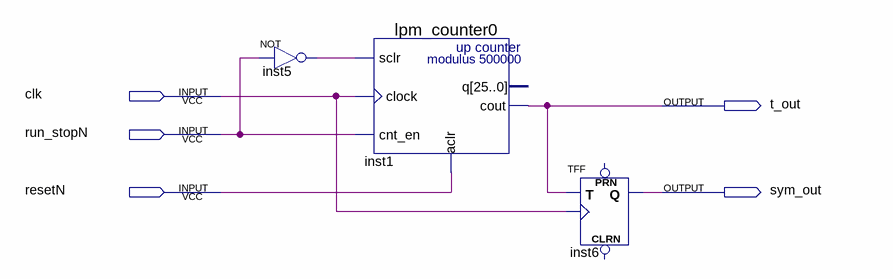
[diagram p0: schematic sheet]
// Quartus schematic secgen.bdf as structural Verilog: 3 symbols, 5 pins
module secgen (
  input  clk,
  input  run_stopN,
  input  resetN,
  output t_out,
  output sym_out
);

  wire inst5_out;

  not inst5 (inst5_out, run_stopN);
  lpm_counter0 inst1 (.sclr(inst5_out), .clock(clk), .cnt_en(run_stopN), .aclr(resetN), .cout(t_out));  // open: q
  TFF inst6 (.T(t_out), .CLK(clk), .Q(sym_out));  // open: PRN, CLRN
endmodule
